# EAGLE design microphone (EAGLE 6.6.0)
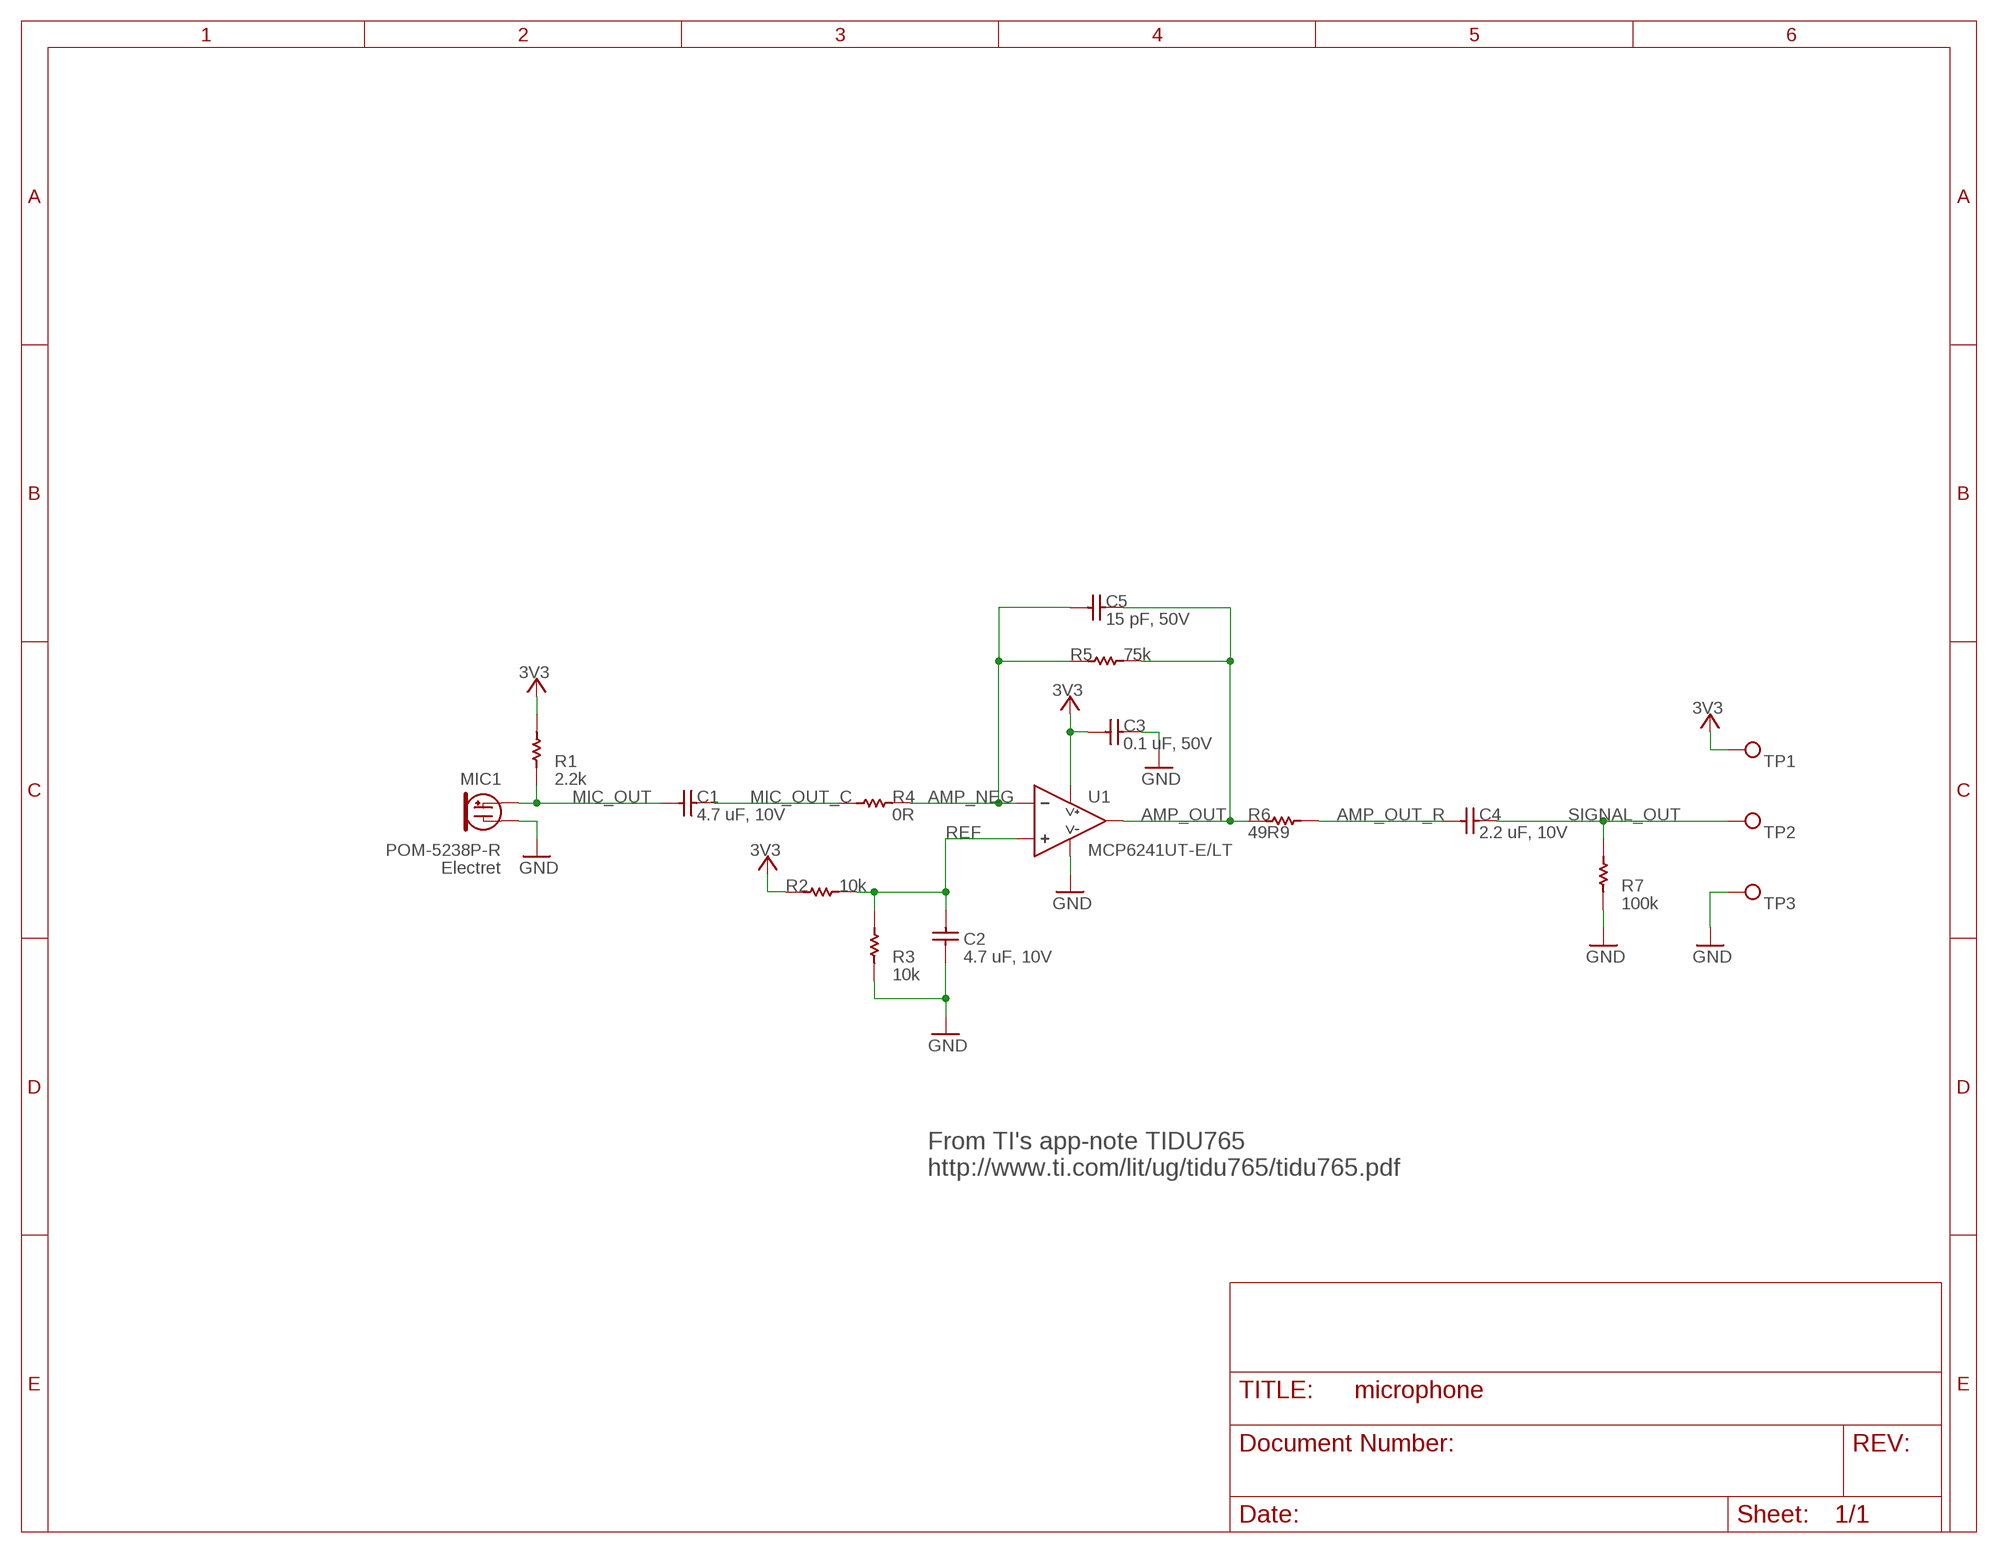
[diagram p0: schematic, sheet 1]

## Parts
C1  CAP_CGB3B1X5R1A475M055AC  [CAP_0603]
C2  CAP_CGB3B1X5R1A475M055AC  [CAP_0603]
C3  CAP_C1608X7R1H104K080AA  [CAP_0603]
C4  CAP_CL10A225KP8NNNC  [CAP_0603]
C5  CAP_CL10C150JB8NNNC  [CAP_0603]
MIC1  POM-5238P-R  [POM-5238P-R]
R1  RES_2K2_ERJ-3EKF2201V  [RES_0603]
R2  RES_10K_RC0603FR-0710KL  [RES_0603]
R3  RES_10K_RC0603FR-0710KL  [RES_0603]
R4  RES_0R_RC0603JR-070RL  [RES_0603]
R5  RES_75K_RC0603FR-0775KL  [RES_0603]
R6  RES_49R9_RC0603FR-0749R9L  [RES_0603]
R7  RES_100K_RC0603FR-07100KL  [RES_0603]
TP1  TP_1P6_MM_ROUND  [TP_1P6_MM_ROUND]
TP2  TP_1P6_MM_ROUND  [TP_1P6_MM_ROUND]
TP3  TP_1P6_MM_ROUND  [TP_1P6_MM_ROUND]
U1  MCP6241UT-E/LT  [SC-70-5_GENERIC]

## Nets
3V3: C3.P$1 R1.P$2 R2.P$2 TP1.P$1(P1) U1.5(V+)
AMP_NEG: C5.P$1 R4.P$2 R5.P$1 U1.3(IN-)
AMP_OUT: C5.P$2 R5.P$2 R6.P$1 U1.4(OUT)
AMP_OUT_R: C4.P$1 R6.P$2
GND: C2.P$1 C3.P$2 MIC1.NEG R3.P$1 R7.P$1 TP3.P$1(P1) U1.2(V-)
MIC_OUT: C1.P$1 MIC1.POS R1.P$1
MIC_OUT_C: C1.P$2 R4.P$1
REF: C2.P$2 R2.P$1 R3.P$2 U1.1(IN+)
SIGNAL_OUT: C4.P$2 R7.P$2 TP2.P$1(P1)

## Notes on the sheet
- From TI's app-note TIDU765
  http://www.ti.com/lit/ug/tidu765/tidu765.pdf

## Library data of the parts
C1 C2 = wedfestdress:CAP_CGB3B1X5R1A475M055AC; COST_X1: 0.24; COST_X100: 0.1; COST_X500: 0.06626; DESCRIPTION: Capacitor, 4.7 uF, 10V, 0603, X5R; DISPLAY: 4.7 uF, 10V; DISTRIBUTOR: Digikey; DIST_PART_NO: 445-7483-1-ND; MFG: TDK; MFG_PART_NO: CGB3B1X5R1A475M055AC; PACKAGE: 0603
C3 = wedfestdress:CAP_C1608X7R1H104K080AA; COST_X1: 0.1; COST_X100: 0.022; COST_X500: 0.0154; DESCRIPTION: Capacitor, 0.1 uF, 50V, 0603, X7R; DISPLAY: 0.1 uF, 50V; DISTRIBUTOR: Digikey; DIST_PART_NO: 445-1314-1-ND; MFG: TDK; MFG_PART_NO: C1608X7R1H104K080AA; PACKAGE: 0603
C4 = wedfestdress:CAP_CL10A225KP8NNNC; COST_X1: 0.12; COST_X100: 0.0408; COST_X500: 0.02878; DESCRIPTION: Capacitor, 2.2 uF, 10V, 0603, X5R; DISPLAY: 2.2 uF, 10V; DISTRIBUTOR: Digikey; DIST_PART_NO: 1276-1085-1-ND; MFG: Samsung; MFG_PART_NO: CL10A225KP8NNNC; PACKAGE: 0603
C5 = wedfestdress:CAP_CL10C150JB8NNNC; COST_X1: 0.1; COST_X100: 0.0126; COST_X500: 0.00898; DESCRIPTION: Capacitor, 15 pF, 50V, 0603, C0G/NP0; DISPLAY: 15 pF, 50V; DISTRIBUTOR: Digikey; DIST_PART_NO: 1276-1296-1-ND; MFG: Samsung; MFG_PART_NO: CL10C150JB8NNNC; PACKAGE: 0603
MIC1 = wedfestdress:POM-5238P-R; COST_X1: 2.52; COST_X100: 1.332; COST_X500: 1.332; DESCRIPTION: Microphone, electret condenser, omnidirectional, -38 dB sensitivity, 20 Hz - 15 kHz, TH; DISPLAY: Electret; DISTRIBUTOR: Digikey; DIST_PART_NO: 668-1324-ND; MFG: PUI Audio; MFG_PART_NO: POM-5238P-R; PACKAGE: TH
R1 = wedfestdress:RES_2K2_ERJ-3EKF2201V; COST_X1: .1; COST_X100: .0084; COST_X500: .00514; DESCRIPTION: Resistor, 2.2k, 1%, 0603, 100 ppm/C; DISPLAY: 2.2k; DISTRIBUTOR: Digikey; DIST_PART_NO: P2.20KHCT-ND; MFG: Panasonic; MFG_PART_NO: ERJ-3EKF2201V; PACKAGE: 0603
R2 R3 = wedfestdress:RES_10K_RC0603FR-0710KL; COST_X1: .01; COST_X100: .0063; COST_X500: .00382; DESCRIPTION: Resistor, 10k, 1%, 0603, 100 ppm/C; DISPLAY: 10k; DISTRIBUTOR: Digikey; DIST_PART_NO: 311-10.0KHRCT-ND; MFG: Yageo; MFG_PART_NO: RC0603FR-0710KL; PACKAGE: 0603
R4 = wedfestdress:RES_0R_RC0603JR-070RL; COST_X1: 0.1; COST_X100: 0.0045; COST_X500: 0.00278; DESCRIPTION: Resistor, 0R, 0603; DISPLAY: 0R; DISTRIBUTOR: Digikey; DIST_PART_NO: 311-0.0GRCT-ND; MFG: Yageo; MFG_PART_NO: RC0603JR-070RL; PACKAGE: 0603
R5 = wedfestdress:RES_75K_RC0603FR-0775KL; COST_X1: .1; COST_X100: .006; COST_X500: .006; DESCRIPTION: Resistor, 75k, 1%, 0603, 100 ppm/C; DISPLAY: 75k; DISTRIBUTOR: Digikey; DIST_PART_NO: 311-75.0KHRCT-ND; MFG: Yageo; MFG_PART_NO: RC0603FR-0775KL; PACKAGE: 0603
R6 = wedfestdress:RES_49R9_RC0603FR-0749R9L; COST_X1: 0.1; COST_X100: 0.0063; COST_X500: 0.00382; DESCRIPTION: Resistor, 49R9, 1%, 0603, 100 ppm/C; DISPLAY: 49R9; DISTRIBUTOR: Digikey; DIST_PART_NO: 311-49.9HRCT-ND; MFG: Yageo; MFG_PART_NO: RC0603FR-0749R9L; PACKAGE: 0603
R7 = wedfestdress:RES_100K_RC0603FR-07100KL; COST_X1: 0.1; COST_X100: .0052; COST_X500: .00316; DESCRIPTION: Resistor, 100k, 1%, 0603, 100 ppm/C; DISPLAY: 100k; DISTRIBUTOR: Digikey; DIST_PART_NO: 311-100KHRCT-ND; MFG: Yageo; MFG_PART_NO: RC0603FR-07100KL; PACKAGE: 0603
TP1-TP3 = wedfestdress:TP_1P6_MM_ROUND: Test Point 1.6 mm Round; DESCRIPTION: Test point, SMT, circular, 1.6 mm diameter; DISPLAY: Test Point
U1 = wedfestdress:MCP6241UT-E/LT; COST_X1: 0.31; COST_X100: 0.2369; COST_X500: 0.2369; DESCRIPTION: OpAmp, 500 kHz GBWP, rail-to-rail, 50 uA Iq; DISTRIBUTOR: Digikey; DIST_PART_NO: MCP6241UT-E/LTCT-ND; MFG: Microchip; MFG_PART_NO: MCP6241UT-E/LT; PACKAGE: SC-70-5

## Board
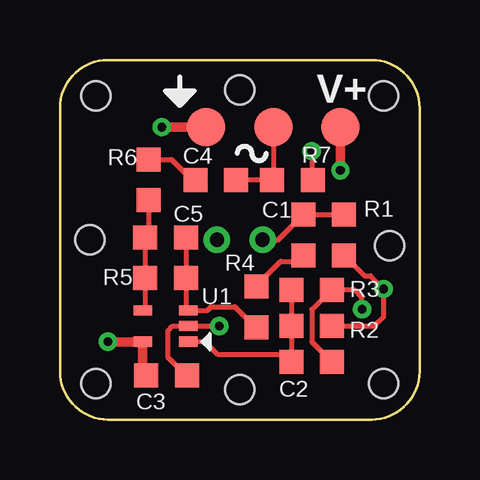
[diagram p1: board, top side]
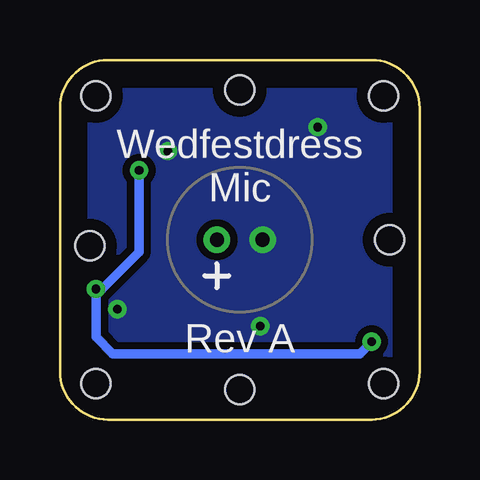
[diagram p2: board, bottom side, seen from below]

Size 15 x 15 mm. Coordinates in mm from the lower left corner, seen from the top.
Outline: 13,0 2,0 arc-90 0,2 0,13 arc-90 2,15 13,15 arc-90 15,13 15,2 arc-90 13,0
Copper layers (1*16): Top 0.035mm / dielectric 1.5mm / Bottom 0.035mm
Design rules "default *": minimum track width 7mil, minimum drill 14mil, track to track 8mil, track to pad 8mil, pad to pad 8mil, via to via 8mil, smd to smd 8mil, copper to edge 20mil, drill to drill 8mil, minimum pad ring 10mil, minimum via ring 8mil, stop-mask expansion 4mil, vias tented up to drill 0mil, thermal gap 10mil
Holes 1.2 mm at 1.5,13.5 13.5,13.5 1.5,1.5 13.5,1.5 1.25,7.5 7.5,13.75 13.75,7.25 7.5,1.25

### Footprints (pad centres in the part's own frame; a part is rotated, then mirrored left to right if it is on the bottom)
CAP_0603 = smd 1 x 1: P$1 -0.85,0; P$2 0.85,0
POM-5238P-R = drill 0.6: NEG 0.95,0; POS -0.95,0
RES_0603 = smd 1 x 1: P$1 -0.85,0; P$2 0.85,0
TP_1P6_MM_ROUND = smd 1.6 x 1.6: P$1 0,0
SC-70-5_GENERIC = smd 0.42 x 0.77: 1 0.65,0.95; 2 0,0.95; 3 -0.65,0.95; 4 -0.65,-0.95; 5 0.65,-0.95

### Placement (x,y rotation side)
C1  10.15,7.7 270 top
C2  10.5,2.4 180 top
C3  4.45,1.85 0 top
C4  6.5,10 0 top
C5  4.4,7.6 180 top
MIC1  7.5,7.5 0 bottom
R1  11.85,7.7 270 top
R2  10.5,3.9 0 top
R3  10.5,5.4 180 top
R4  8.2,4.7 270 top
R5  4.4,5.9 180 top
R6  3.7,10 90 top
R7  9.7,10 180 top
TP1  11.7,12.2 0 top
TP2  8.9,12.2 0 top
TP3  6.1,12.2 0 top
U1  4.4,3.9 270 top

### Tracks (layer width: path | path; a pad name or v marks a point on that pad's centre or on a via)
3V3  (via drill 0.36 pad 0.61)
  Top 0.2: R1.P$2 11.9,6.85 11.9,6.8 12.7,6 12.95,6 v13.5,5.45 13.5,4.3 13.1,3.9 R2.P$2
  Top 0.4: v2,3.25 U1.5 3.45,2 C3.P$1 | v11.7,10.4 TP1.P$1 11.7,12.3
  Bottom 0.4: v11.7,10.4 11.7,7 13.25,5.45 v13.5,5.45 13.5,3.45 12.8,2.75 2.5,2.75 v2,3.25
AMP_NEG
  Top 0.2: C5.P$1 R5.P$1 5.25,4.65 U1.3 6.15,4.55 6.3,4.7 7.3,4.7 8.15,3.85 R4.P$2
AMP_OUT
  Top 0.2: R6.P$1 3.7,7.75 C5.P$2 R5.P$2 3.55,4.65 U1.4
AMP_OUT_R
  Top 0.2: C4.P$1 5.5,10 4.65,10.85 R6.P$2
GND  (via drill 0.36 pad 0.61)
  Top 0.2: 5.3,3.85 U1.2 | U1.2 v6.65,3.9 | 10.55,10.25 R7.P$1 10.5,10.05 v10.5,11.2 | C2.P$1 10.5,3.25 10.5,4.6 11.3,5.4 R3.P$1 12.3,5.4 12.6,5.1 v12.6,4.6 | C3.P$2 5.25,1.85 4.5,2.6 4.5,3.7 4.7,3.9 U1.2
  Top 0.4: TP3.P$1 v4.25,12.2
  Bottom 0.2: v6.65,3.9 6.85,3.9
  pour Bottom (isolate 0.3, no thermals): 1.25,12.75 1.25,2.25 arc90 2.25,1.25 12.75,1.25 arc90 13.75,2.25 13.75,12.75 arc90 12.75,13.75 2.25,13.75 arc90
MIC_OUT
  Top 0.2: MIC1.POS 9.1,7.5 C1.P$1 R1.P$1
MIC_OUT_C
  Top 0.2: R4.P$1 8.2,5.6 9.2,6.6 9.9,6.6 C1.P$2
REF
  Top 0.2: R3.P$2 R2.P$1 C2.P$2 9.35,2.7 6.6,2.7 6.05,3.25 U1.1
SIGNAL_OUT
  Top 0.2: 7.5,10.15 C4.P$2 R7.P$2 8.9,10.05 TP2.P$1

### Text on the board
tPlace: V+
bPlace: Wedfestdress / Mic | Rev A